# EAGLE schematic MAPE-CUN-Large-010 (EAGLE 7.3.0)
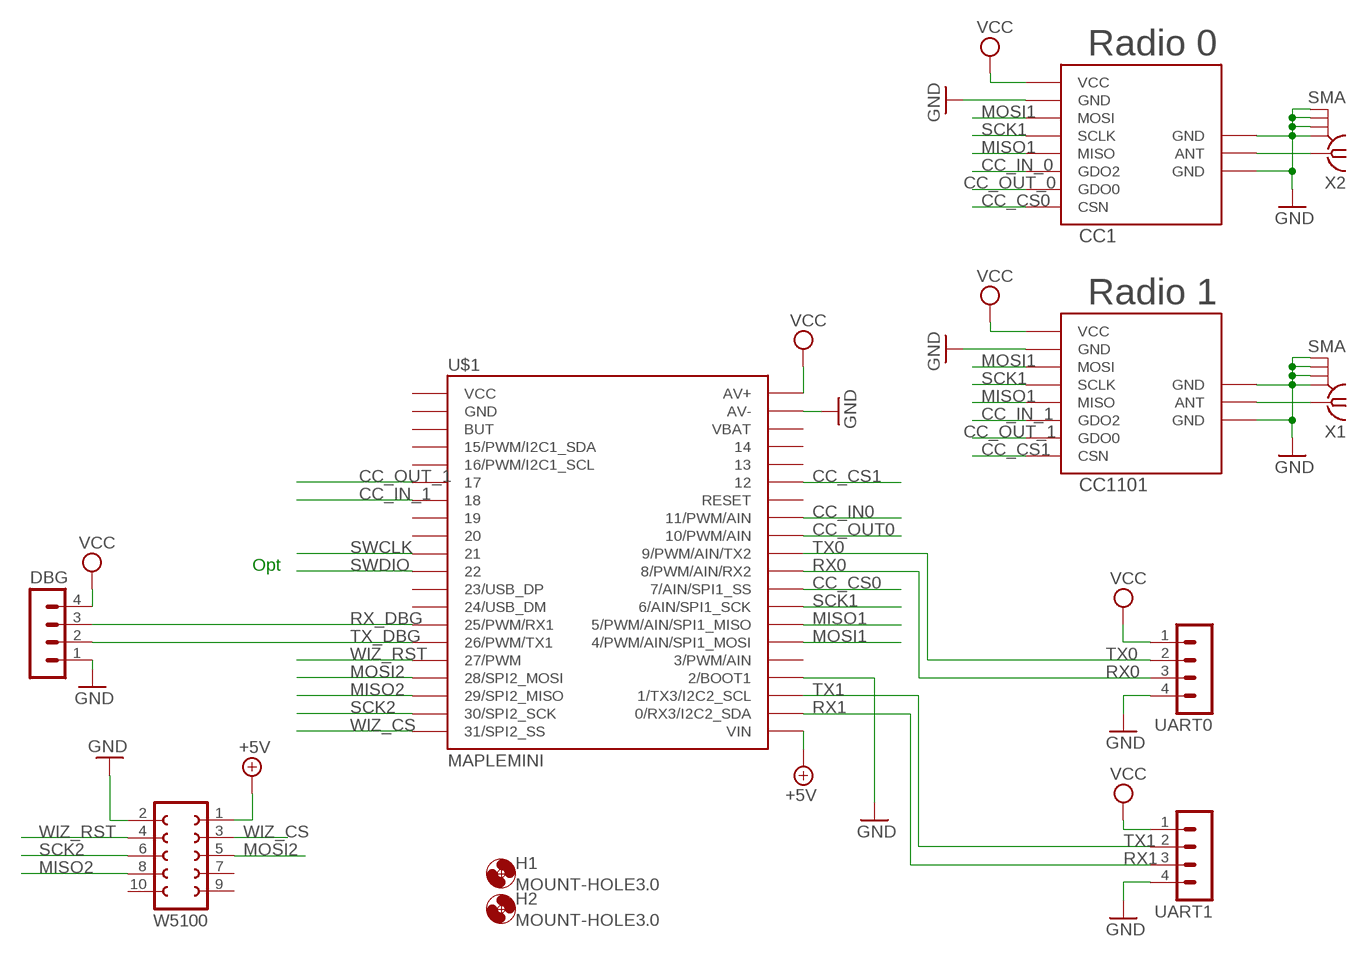
[diagram p0: schematic, sheet 1]

## Parts
CC1  CC1101_MODULE1SMD  [CC1101_MODULE1_SMD]
CC1101  CC1101_MODULE1SMD  [CC1101_MODULE1_SMD]
DBG  MA04-1  [MA04-1]
H1  MOUNT-HOLE3.0  [3,0]
H2  MOUNT-HOLE3.0  [3,0]
U$1  MAPLEMINI  [20-DIP]
UART0  MA04-1  [MA04-1]
UART1  MA04-1  [MA04-1]
W5100  FE05-2  [FE05-2]
X1  SMA  [SMA]
X2  SMA  [SMA]

## Nets
+5V: U$1.21(VIN) W5100.1
CC_CS0: CC1.CSN U$1.29(7/AIN/SPI1_SS)
CC_CS1: CC1101.CSN U$1.35
CC_IN0: U$1.33(11/PWM/AIN)
CC_IN_0: CC1.GDO2
CC_IN_1: CC1101.GDO2 U$1.7
CC_OUT0: U$1.32(10/PWM/AIN)
CC_OUT_0: CC1.GDO0
CC_OUT_1: CC1101.GDO0 U$1.6
GND: CC1.GND@0(GND) CC1.GND@1(GND) CC1.GND@2(GND) CC1101.GND@0(GND) CC1101.GND@1(GND) CC1101.GND@2(GND) DBG.1 U$1.24(2/BOOT1) U$1.39(AV-) UART0.4 UART1.4 W5100.2 X1.GND@1 X1.GND@2 X1.GND@3 X1.GND@4 X2.GND@1 X2.GND@2 X2.GND@3 X2.GND@4
MISO1: CC1.MISO CC1101.MISO U$1.27(5/PWM/AIN/SPI1_MISO)
MISO2: U$1.18(29/SPI2_MISO) W5100.8
MOSI1: CC1.MOSI CC1101.MOSI U$1.26(4/PWM/AIN/SPI1_MOSI)
MOSI2: U$1.17(28/SPI2_MOSI) W5100.5
N$3: CC1101.ANT X1.1
N$4: CC1.ANT X2.1
RX0: U$1.30(8/PWM/AIN/RX2) UART0.3
RX1: U$1.22(0/RX3/I2C2_SDA) UART1.3
RX_DBG: DBG.3 U$1.14(25/PWM/RX1)
SCK1: CC1.SCLK CC1101.SCLK U$1.28(6/AIN/SPI1_SCK)
SCK2: U$1.19(30/SPI2_SCK) W5100.6
SWCLK: U$1.10
SWDIO: U$1.11
TX0: U$1.31(9/PWM/AIN/TX2) UART0.2
TX1: U$1.23(1/TX3/I2C2_SCL) UART1.2
TX_DBG: DBG.2 U$1.15(26/PWM/TX1)
VCC: CC1.VCC CC1101.VCC DBG.4 U$1.40(AV+) UART0.1 UART1.1
WIZ_CS: U$1.20(31/SPI2_SS) W5100.3
WIZ_RST: U$1.16(27/PWM) W5100.4
Unconnected: U$1.1(VCC) U$1.2(GND) U$1.3(BUT) U$1.4(15/PWM/I2C1_SDA) U$1.5(16/PWM/I2C1_SCL) U$1.8 U$1.9 U$1.12(23/USB_DP) U$1.13(24/USB_DM) U$1.25(3/PWM/AIN) U$1.34(RESET) U$1.36 U$1.37 U$1.38(VBAT) W5100.7 W5100.9 W5100.10

## Notes on the sheet
- Radio 0
- Radio 1
- Opt

## Library data of the parts
CC1 CC1101 = wireless:CC1101_MODULE1: CC1101 wireless module for 433/868 MHz (sold from Aliexpress). DIL version for mounting with pin header (and SMD soldering) and SMD only variant available.
DBG UART0 UART1 = con-lstb:MA04-1: PIN HEADER; OC_FARNELL: unknown; OC_NEWARK: unknown
H1 H2 = holes:MOUNT-HOLE: MOUNTING HOLE with drill center marker
U$1 = maplemini-small:MAPLEMINI
W5100 = con-lsta:FE05-2: FEMALE HEADER; OC_FARNELL: unknown; OC_NEWARK: unknown
X1 X2 = sma:SMA: SMA 50 Ohm end launch jack receptacle - round contact

## Net classes
0 default: width 0.406 mm
1 PWR: width 0.305 mm